# EAGLE design Main BoardV2 (EAGLE 9.1.3)
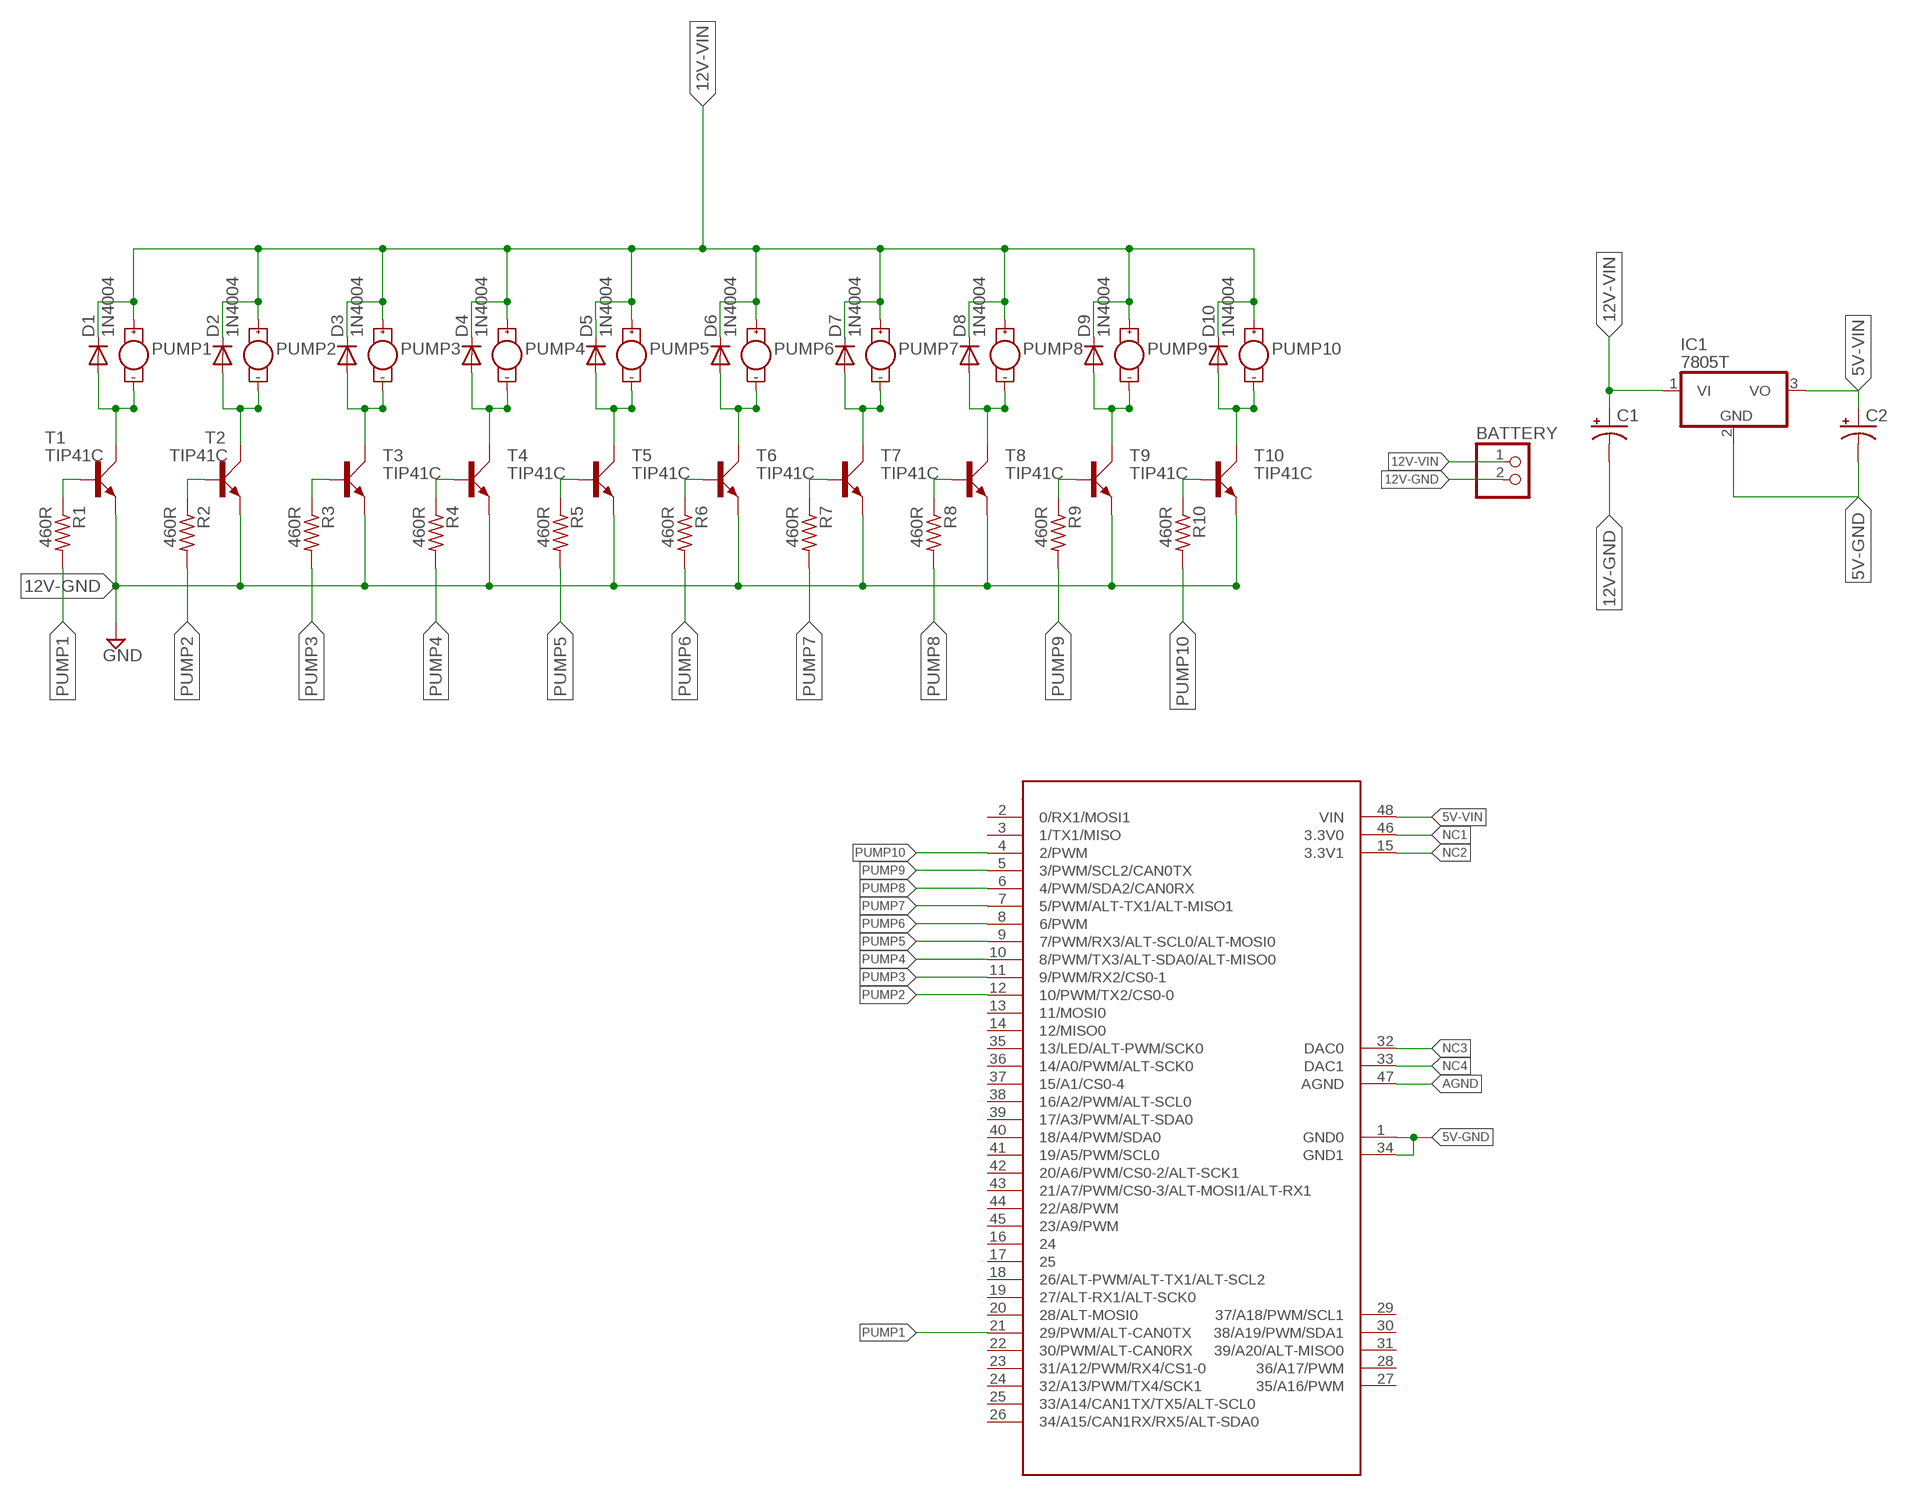
[diagram p0: schematic, sheet 1]

## Parts
BATTERY  PINHD-1X2  [1X02]
C1  CPOL-USE5-10.5  [E5-10,5]
C2  CPOL-USE2.5-5  [E2,5-5]
D1  1N4004  [DO41-10]
D2  1N4004  [DO41-10]
D3  1N4004  [DO41-10]
D4  1N4004  [DO41-10]
D5  1N4004  [DO41-10]
D6  1N4004  [DO41-10]
D7  1N4004  [DO41-10]
D8  1N4004  [DO41-10]
D9  1N4004  [DO41-10]
D10  1N4004  [DO41-10]
IC1  7805T  [TO220H]
PUMP1  PUMPS  [1X2_HEADER]
PUMP2  PUMPS  [1X2_HEADER]
PUMP3  PUMPS  [1X2_HEADER]
PUMP4  PUMPS  [1X2_HEADER]
PUMP5  PUMPS  [1X2_HEADER]
PUMP6  PUMPS  [1X2_HEADER]
PUMP7  PUMPS  [1X2_HEADER]
PUMP8  PUMPS  [1X2_HEADER]
PUMP9  PUMPS  [1X2_HEADER]
PUMP10  PUMPS  [1X2_HEADER]
R1  460R  R-US_FLIPFLOP  [0805-THM]
R2  460R  R-US_FLIPFLOP  [0805-THM]
R3  460R  R-US_FLIPFLOP  [0805-THM]
R4  460R  R-US_FLIPFLOP  [0805-THM]
R5  460R  R-US_FLIPFLOP  [0805-THM]
R6  460R  R-US_FLIPFLOP  [0805-THM]
R7  460R  R-US_FLIPFLOP  [0805-THM]
R8  460R  R-US_FLIPFLOP  [0805-THM]
R9  460R  R-US_FLIPFLOP  [0805-THM]
R10  460R  R-US_FLIPFLOP  [0805-THM]
T1  TIP41C  [TO220AV]
T2  TIP41C  [TO220AV]
T3  TIP41C  [TO220AV]
T4  TIP41C  [TO220AV]
T5  TIP41C  [TO220AV]
T6  TIP41C  [TO220AV]
T7  TIP41C  [TO220AV]
T8  TIP41C  [TO220AV]
T9  TIP41C  [TO220AV]
T10  TIP41C  [TO220AV]
TEENSY1  TEENSY_3.5  [DIP1524W60P254L6350H635Q48A]

## Nets
5V-GND [supply]: C2.- IC1.2(GND) TEENSY1.1(GND0) TEENSY1.34(GND1)
5V-VIN: C2.+ IC1.3(VO) TEENSY1.48(VIN)
12V-GND: BATTERY.2 C1.- T1.E T2.E T3.E T4.E T5.E T6.E T7.E T8.E T9.E T10.E ; supply symbol labelled GND
12V-VIN: BATTERY.1 C1.+ D1.C D2.C D3.C D4.C D5.C D6.C D7.C D8.C D9.C D10.C IC1.1(VI) PUMP1.1(+) PUMP2.1(+) PUMP3.1(+) PUMP4.1(+) PUMP5.1(+) PUMP6.1(+) PUMP7.1(+) PUMP8.1(+) PUMP9.1(+) PUMP10.1(+)
AGND: TEENSY1.47(AGND)
N$21: D10.A PUMP10.2(-) T10.C
N$22: D9.A PUMP9.2(-) T9.C
N$23: D8.A PUMP8.2(-) T8.C
N$24: D7.A PUMP7.2(-) T7.C
N$25: D6.A PUMP6.2(-) T6.C
N$26: D5.A PUMP5.2(-) T5.C
N$27: D4.A PUMP4.2(-) T4.C
N$28: D3.A PUMP3.2(-) T3.C
N$29: D2.A PUMP2.2(-) T2.C
N$30: D1.A PUMP1.2(-) T1.C
N$31: R1.1 T1.B
N$32: R2.1 T2.B
N$33: R3.1 T3.B
N$34: R4.1 T4.B
N$35: R5.1 T5.B
N$36: R6.1 T6.B
N$37: R7.1 T7.B
N$38: R8.1 T8.B
N$39: R9.1 T9.B
N$40: R10.1 T10.B
NC1: TEENSY1.46(3.3V0)
NC2: TEENSY1.15(3.3V1)
NC3: TEENSY1.32(DAC0)
NC4: TEENSY1.33(DAC1)
PUMP1: R1.2 TEENSY1.21(29/PWM/ALT-CAN0TX)
PUMP2: R2.2 TEENSY1.12(10/PWM/TX2/CS0-0)
PUMP3: R3.2 TEENSY1.11(9/PWM/RX2/CS0-1)
PUMP4: R4.2 TEENSY1.10(8/PWM/TX3/ALT-SDA0/ALT-MISO0)
PUMP5: R5.2 TEENSY1.9(7/PWM/RX3/ALT-SCL0/ALT-MOSI0)
PUMP6: R6.2 TEENSY1.8(6/PWM)
PUMP7: R7.2 TEENSY1.7(5/PWM/ALT-TX1/ALT-MISO1)
PUMP8: R8.2 TEENSY1.6(4/PWM/SDA2/CAN0RX)
PUMP9: R9.2 TEENSY1.5(3/PWM/SCL2/CAN0TX)
PUMP10: R10.2 TEENSY1.4(2/PWM)
Unconnected: TEENSY1.2(0/RX1/MOSI1) TEENSY1.3(1/TX1/MISO) TEENSY1.13(11/MOSI0) TEENSY1.14(12/MISO0) TEENSY1.16 TEENSY1.17 TEENSY1.18(26/ALT-PWM/ALT-TX1/ALT-SCL2) TEENSY1.19(27/ALT-RX1/ALT-SCK0) TEENSY1.20(28/ALT-MOSI0) TEENSY1.22(30/PWM/ALT-CAN0RX) TEENSY1.23(31/A12/PWM/RX4/CS1-0) TEENSY1.24(32/A13/PWM/TX4/SCK1) TEENSY1.25(33/A14/CAN1TX/TX5/ALT-SCL0) TEENSY1.26(34/A15/CAN1RX/RX5/ALT-SDA0) TEENSY1.27(35/A16/PWM) TEENSY1.28(36/A17/PWM) TEENSY1.29(37/A18/PWM/SCL1) TEENSY1.30(38/A19/PWM/SDA1) TEENSY1.31(39/A20/ALT-MISO0) TEENSY1.35(13/LED/ALT-PWM/SCK0) TEENSY1.36(14/A0/PWM/ALT-SCK0) TEENSY1.37(15/A1/CS0-4) TEENSY1.38(16/A2/PWM/ALT-SCL0) TEENSY1.39(17/A3/PWM/ALT-SDA0) TEENSY1.40(18/A4/PWM/SDA0) TEENSY1.41(19/A5/PWM/SCL0) TEENSY1.42(20/A6/PWM/CS0-2/ALT-SCK1) TEENSY1.43(21/A7/PWM/CS0-3/ALT-MOSI1/ALT-RX1) TEENSY1.44(22/A8/PWM) TEENSY1.45(23/A9/PWM)

## Library data of the parts
BATTERY = pinhead:PINHD-1X2: PIN HEADER; SPICEPREFIX: B
C1 C2 = adafruit:CPOL-US: POLARIZED CAPACITOR, American symbol
D1-D10 = adafruit:1N4004: DIODE General purpose 1N400x type rectifier (With bigger pads) http://www.ladyada.net/library/pcb/eaglelibrary.html
IC1 = adafruit:78*: Positive VOLTAGE REGULATOR Added bigger pads to the TO-92 package
PUMP1-PUMP10 = Peristaltic pump:PUMP
R1-R10 = adafruit:R-US_: RESISTOR, American symbol
T1-T10 = transistor-power:TIP41C: NPN TRANSISTOR
TEENSY1 = Teensy_3.5:TEENSY_3.5

## Net classes
0 default: width 0.152 mm, clearance 0.205 mm
1 supply: width 0.305 mm, clearance 0.205 mm to class 0, clearance 0.205 mm
2 signal: width 0.152 mm, clearance 0.205 mm to class 0, clearance 0.205 mm to class 1, clearance 0.205 mm
3 AGND: width 0.203 mm
4 DAC: width 0.203 mm

## Board
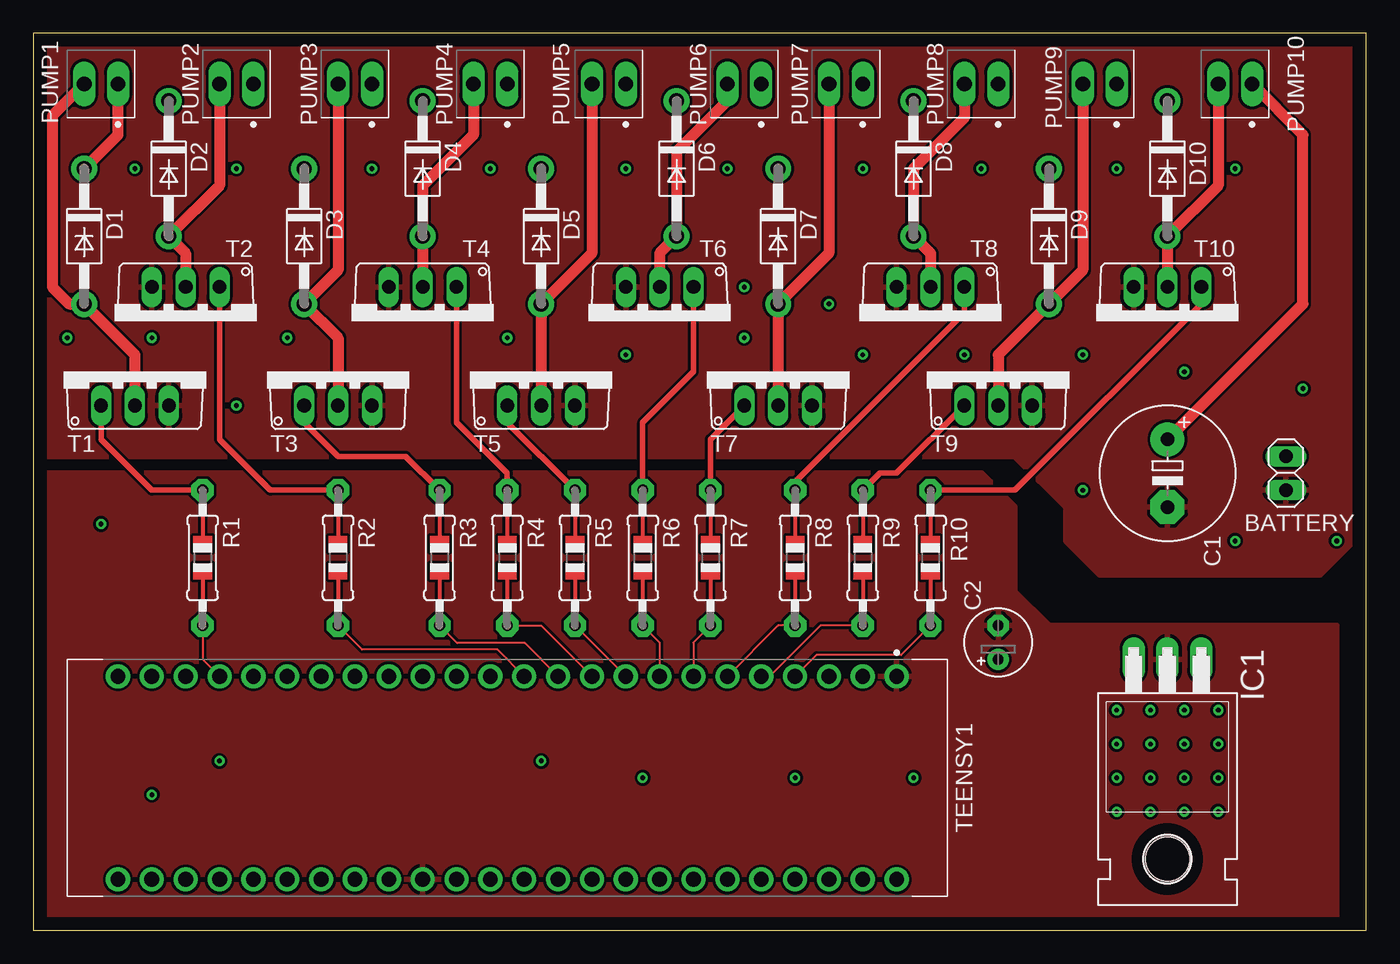
[diagram p1: board, top side]
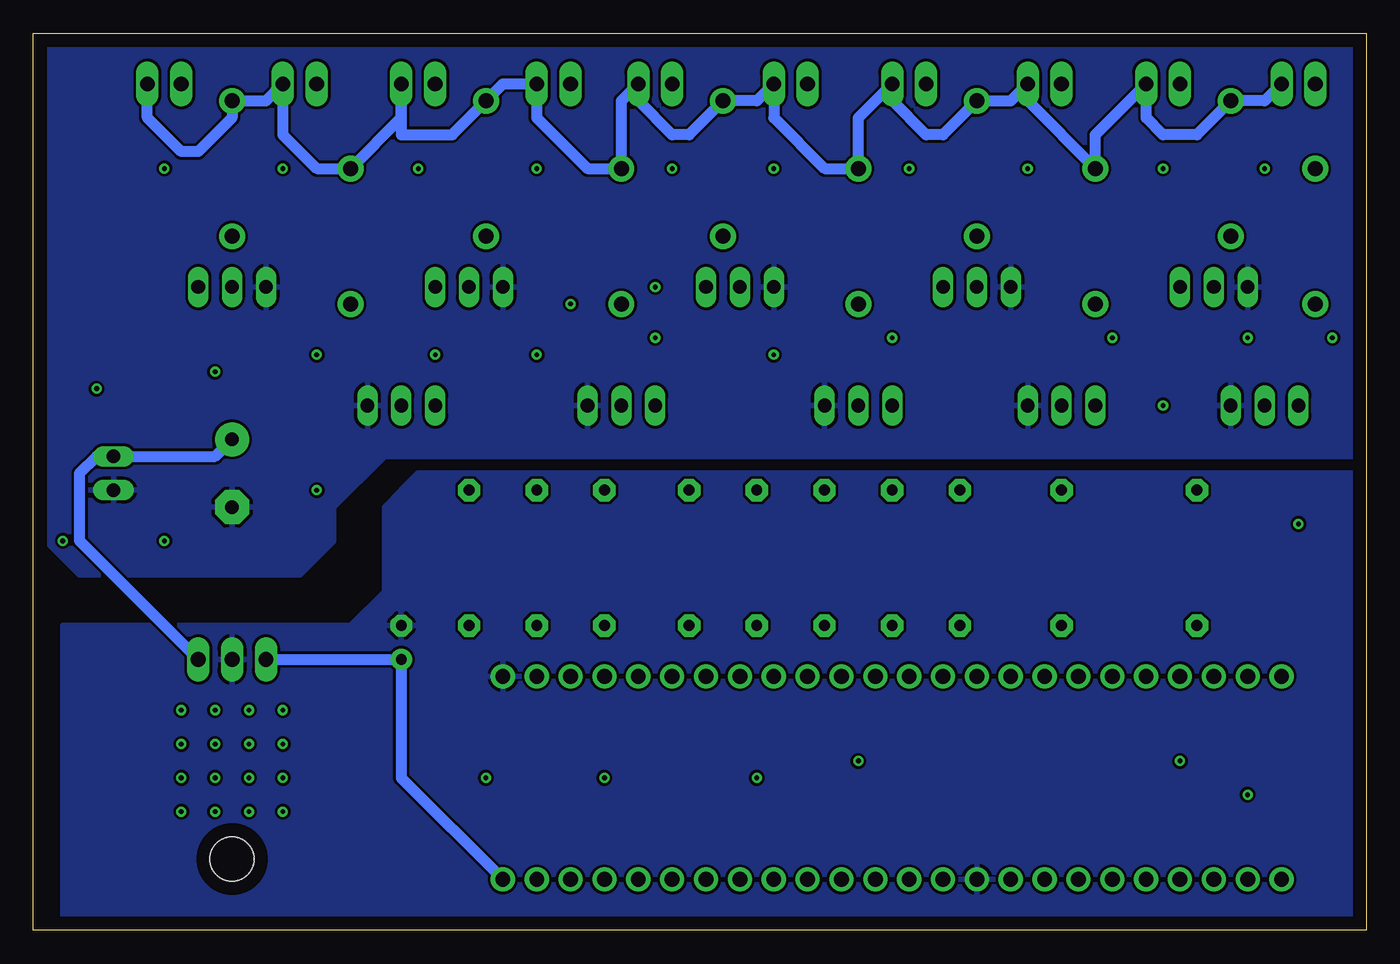
[diagram p2: board, bottom side, seen from below]

Size 100 x 67.3 mm. Coordinates in mm from the lower left corner, seen from the top.
Outline: 0,0 100,0 100,67.3 0,67.3 0,0
Copper layers (1*16): Top 0.035mm / dielectric 1.5mm / Bottom 0.035mm
Design rules "default *": minimum track width 6mil, minimum drill 0.35mm, track to track 6mil, track to pad 6mil, pad to pad 6mil, via to via 6mil, smd to smd 6mil, copper to edge 40mil, drill to drill 10mil, minimum pad ring 10mil, minimum via ring 8mil, stop-mask expansion 4mil, vias tented up to drill 0mil, thermal gap 10mil

### Footprints (pad centres in the part's own frame; a part is rotated, then mirrored left to right if it is on the bottom)
1X02 = drill 1.016 long: 1 -1.27,0; 2 1.27,0
E5-10,5 = drill 1.016 pad 2.54: + -2.54,0 | drill 1.016 pad 2.54 octagon: - 2.54,0
E2,5-5 = drill 0.813 pad 1.6: + -1.27,0 | drill 0.813 pad 1.6 octagon: - 1.27,0
DO41-10 = drill 1.118 pad 1.93: A 5.08,0; C -5.08,0
TO220H = drill 1.118 long: 1 -2.54,-10.16; 2 0,-10.16; 3 2.54,-10.16 | hole 3.302: 0,4.826
1X2_HEADER = drill 1.105 pad 1.705 long: 1 0,0; 2 2.54,0
0805-THM = drill 0.813 pad 1.676 octagon: 1 -5.08,0; 2 5.08,0
TO220AV = drill 1.016 long: B -2.54,-2.54; C 0,-2.54; E 2.54,-2.54
DIP1524W60P254L6350H635Q48A = drill 1.112 pad 1.812: 1 -7.62,29.21; 2 -7.62,26.67; 3 -7.62,24.13; 4 -7.62,21.59; 5 -7.62,19.05; 6 -7.62,16.51; 7 -7.62,13.97; 8 -7.62,11.43; 9 -7.62,8.89; 10 -7.62,6.35; 11 -7.62,3.81; 12 -7.62,1.27; 13 -7.62,-1.27; 14 -7.62,-3.81; 15 -7.62,-6.35; 16 -7.62,-8.89; 17 -7.62,-11.43; 18 -7.62,-13.97; 19 -7.62,-16.51; 20 -7.62,-19.05; 21 -7.62,-21.59; 22 -7.62,-24.13; 23 -7.62,-26.67; 24 -7.62,-29.21; 25 7.62,-29.21; 26 7.62,-26.67; 27 7.62,-24.13; 28 7.62,-21.59; 29 7.62,-19.05; 30 7.62,-16.51; 31 7.62,-13.97; 32 7.62,-11.43; 33 7.62,-8.89; 34 7.62,-6.35; 35 7.62,-3.81; 36 7.62,-1.27; 37 7.62,1.27; 38 7.62,3.81; 39 7.62,6.35; 40 7.62,8.89; 41 7.62,11.43; 42 7.62,13.97; 43 7.62,16.51; 44 7.62,19.05; 45 7.62,21.59; 46 7.62,24.13; 47 7.62,26.67; 48 7.62,29.21

### Placement (x,y rotation side)
BATTERY  93.98,34.29 270 top
C1  85.09,34.29 270 top
C2  72.39,21.59 90 top
D1  3.81,52.07 270 top
D2  10.16,57.15 270 top
D3  20.32,52.07 270 top
D4  29.21,57.15 270 top
D5  38.1,52.07 270 top
D6  48.26,57.15 270 top
D7  55.88,52.07 270 top
D8  66.04,57.15 270 top
D9  76.2,52.07 270 top
D10  85.09,57.15 270 top
IC1  85.09,10.16 180 top
PUMP1  6.35,63.5 180 top
PUMP2  16.51,63.5 180 top
PUMP3  25.4,63.5 180 top
PUMP4  35.56,63.5 180 top
PUMP5  44.45,63.5 180 top
PUMP6  54.61,63.5 180 top
PUMP7  62.23,63.5 180 top
PUMP8  72.39,63.5 180 top
PUMP9  81.28,63.5 180 top
PUMP10  91.44,63.5 180 top
R1  12.7,27.94 270 top
R2  22.86,27.94 270 top
R3  30.48,27.94 270 top
R4  35.56,27.94 270 top
R5  40.64,27.94 270 top
R6  45.72,27.94 270 top
R7  50.8,27.94 270 top
R8  57.15,27.94 270 top
R9  62.23,27.94 270 top
R10  67.31,27.94 270 top
T1  7.62,41.91 0 top
T2  11.43,45.72 180 top
T3  22.86,41.91 0 top
T4  29.21,45.72 180 top
T5  38.1,41.91 0 top
T6  46.99,45.72 180 top
T7  55.88,41.91 0 top
T8  67.31,45.72 180 top
T9  72.39,41.91 0 top
T10  85.09,45.72 180 top
TEENSY1  35.56,11.43 270 top

### Tracks (layer width: path | path; a pad name or v marks a point on that pad's centre or on a via)
5V-GND
  pour Bottom: 1.27,34.29 71.12,34.29 72.39,33.02 73.66,31.75 73.66,25.4 76.2,22.86 83.82,22.86 97.79,22.86 97.79,0 0,0 0,34.29
  pour Top: 0,34.29 71.12,34.29 73.66,31.75 73.66,25.4 76.2,22.86 97.79,22.86 97.79,0 0,0
5V-VIN
  Bottom 0.813: IC1.3 C2.+ 72.39,11.43 TEENSY1.48
12V-GND
  pour Top: -1.27,36.83 0,35.56 73.66,35.56 77.47,31.75 77.47,29.21 80.01,26.67 87.63,26.67 96.52,26.67 99.06,29.21 99.06,67.31 0,67.31 -1.27,67.31
  pour Bottom: -1.27,67.31 99.06,67.31 99.06,29.21 96.52,26.67 80.01,26.67 77.47,29.21 77.47,31.75 73.66,35.56 0,35.56 -1.27,36.83
12V-VIN
  Top 0.813: D1.C 6.35,59.69 PUMP1.1 | C1.+ 95.25,46.99 95.25,59.69 PUMP10.1
  Bottom 0.813: PUMP10.1 91.44,60.96 88.9,58.42 87.63,58.42 85.09,60.96 D10.C 82.55,62.23 PUMP9.1 81.28,59.69 78.74,57.15 D9.C 72.39,60.96 PUMP8.1 72.39,59.69 68.58,59.69 D8.C 64.77,63.5 PUMP7.1 62.23,60.96 58.42,57.15 D7.C 55.88,62.23 PUMP6.1 54.61,62.23 52.07,59.69 50.8,59.69 D6.C 45.72,62.23 PUMP5.1 44.45,60.96 40.64,57.15 D5.C 38.1,60.96 PUMP4.1 35.56,62.23 33.02,59.69 31.75,59.69 D4.C 26.67,62.23 PUMP3.1 25.4,62.23 D3.C 20.32,59.69 PUMP2.1 16.51,60.96 15.24,59.69 12.7,59.69 D2.C 7.62,62.23 PUMP1.1 | IC1.1 96.52,29.21 96.52,34.29 95.25,35.56 BATTERY.1 86.36,35.56 C1.+
N$1  (via drill 0.35)
  other vias: 7.62,57.15
N$2  (via drill 0.35)
  other vias: 8.89,44.45
N$3  (via drill 0.35)
  other vias: 2.54,44.45
N$4  (via drill 0.35)
  other vias: 19.05,44.45
N$5  (via drill 0.35)
  other vias: 15.24,39.37
N$6  (via drill 0.35)
  other vias: 15.24,57.15
N$7  (via drill 0.35)
  other vias: 25.4,57.15
N$8  (via drill 0.35)
  other vias: 34.29,57.15
N$9  (via drill 0.35)
  other vias: 44.45,57.15
N$10  (via drill 0.35)
  other vias: 52.07,57.15
N$11  (via drill 0.35)
  other vias: 62.23,57.15
N$12  (via drill 0.35)
  other vias: 71.12,57.15
N$13  (via drill 0.35)
  other vias: 81.28,57.15
N$14  (via drill 0.35)
  other vias: 90.17,57.15
N$15  (via drill 0.35)
  other vias: 95.25,40.64
N$16  (via drill 0.35)
  other vias: 90.17,29.21
N$21
  Top 0.813: PUMP10.2 88.9,55.88 D10.A T10.C
N$22
  Top 0.813: PUMP9.2 78.74,49.53 D9.A 72.39,43.18 T9.C
N$23
  Top 0.813: PUMP8.2 69.85,60.96 66.04,57.15 D8.A 67.31,50.8 T8.C
N$24
  Top 0.813: PUMP7.2 59.69,50.8 D7.A T7.C
N$25
  Top 0.813: PUMP6.2 52.07,62.23 48.26,58.42 D6.A 46.99,50.8 T6.C
N$26
  Top 0.813: PUMP5.2 41.91,50.8 D5.A T5.C
N$27
  Top 0.813: PUMP4.2 33.02,59.69 29.21,55.88 D4.A T4.C
N$28
  Top 0.813: PUMP3.2 22.86,49.53 D3.A 22.86,44.45 T3.C
N$29
  Top 0.813: PUMP2.2 13.97,55.88 D2.A 11.43,50.8 T2.C
N$30
  Top 0.813: PUMP1.2 1.42,61.11 1.42,48.26 2.69,46.99 D1.A 7.62,43.18 T1.C
N$31
  Top 0.406: R1.1 8.89,33.02 5.08,36.83 T1.B
N$32
  Top 0.406: R2.1 17.78,33.02 13.97,36.83 T2.B
N$33
  Top 0.406: T3.B 20.32,38.1 22.86,35.56 27.94,35.56 R3.1
N$34
  Top 0.406: T4.B 31.75,38.1 35.56,34.29 R4.1
N$35
  Top 0.406: T5.B 35.56,38.1 R5.1
N$36
  Top 0.406: T6.B 49.53,41.91 45.72,38.1 R6.1
N$37
  Top 0.406: T7.B 50.8,36.83 R7.1
N$38
  Top 0.406: T8.B 69.85,46.33 57.15,33.63 R8.1
N$39
  Top 0.406: R9.1 63.5,34.29 64.77,34.29 T9.B
N$40
  Top 0.406: R10.1 73.66,33.02 87.63,46.99 T10.B
N$42  (via drill 0.35)
  other vias: 78.74,33.02
N$43  (via drill 0.35)
  other vias: 86.36,41.91
N$44  (via drill 0.35)
  other vias: 78.74,43.18
N$45  (via drill 0.35)
  other vias: 97.79,29.21
N$46  (via drill 0.35)
  other vias: 59.69,46.99
N$47  (via drill 0.35)
  other vias: 53.34,48.26
N$49  (via drill 0.35)
  other vias: 35.56,44.45
N$50  (via drill 0.35)
  other vias: 44.45,43.18
N$51  (via drill 0.35)
  other vias: 53.34,44.45
N$52  (via drill 0.35)
  other vias: 62.23,43.18
N$53  (via drill 0.35)
  other vias: 69.85,43.18
N$58  (via drill 0.35)
  other vias: 88.9,16.51
N$59  (via drill 0.35)
  other vias: 88.9,13.97
N$60  (via drill 0.35)
  other vias: 88.9,11.43
N$61  (via drill 0.35)
  other vias: 88.9,8.89
N$65  (via drill 0.35)
  other vias: 86.36,16.51
N$66  (via drill 0.35)
  other vias: 86.36,13.97
N$67  (via drill 0.35)
  other vias: 86.36,11.43
N$68  (via drill 0.35)
  other vias: 86.36,8.89
N$69  (via drill 0.35)
  other vias: 83.82,16.51
N$70  (via drill 0.35)
  other vias: 83.82,13.97
N$71  (via drill 0.35)
  other vias: 83.82,11.43
N$72  (via drill 0.35)
  other vias: 83.82,8.89
N$73  (via drill 0.35)
  other vias: 81.28,16.51
N$74  (via drill 0.35)
  other vias: 81.28,13.97
N$75  (via drill 0.35)
  other vias: 81.28,11.43
N$76  (via drill 0.35)
  other vias: 81.28,8.89
N$83  (via drill 0.35)
  other vias: 66.04,11.43
N$84  (via drill 0.35)
  other vias: 57.15,11.43
N$85  (via drill 0.35)
  other vias: 45.72,11.43
N$86  (via drill 0.35)
  other vias: 38.1,12.7
N$87  (via drill 0.35)
  other vias: 13.97,12.7
N$88  (via drill 0.35)
  other vias: 8.89,10.16
N$90  (via drill 0.35)
  other vias: 5.08,30.48
PUMP1
  Top 0.152: R1.2 12.7,20.32 TEENSY1.21
PUMP2
  Top 0.152: TEENSY1.12 34.82,21.06 24.66,21.06 R2.2
PUMP3
  Top 0.152: TEENSY1.11 36.88,21.54 31.8,21.54 R3.2
PUMP4
  Top 0.152: R4.2 38.1,22.86 TEENSY1.10
PUMP5
  Top 0.152: R5.2 TEENSY1.9
PUMP6
  Top 0.152: R6.2 46.99,21.59 TEENSY1.8
PUMP7
  Top 0.152: R7.2 49.53,21.59 TEENSY1.7
PUMP8
  Top 0.152: R8.2 55.88,22.86 TEENSY1.6
PUMP9
  Top 0.152: R9.2 59.06,22.86 55.25,19.05 TEENSY1.5
PUMP10
  Top 0.152: R10.2 65.1,20.65 58.75,20.65 TEENSY1.4